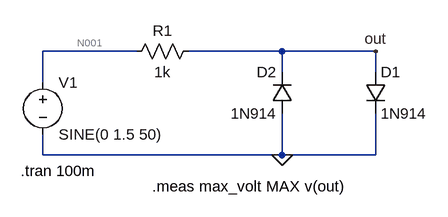
[diagram p0: schematic обмежувач.asc]
обмежувач.asc, the LTspice schematic file:
Version 4
SHEET 1 880 680
WIRE 112 112 -32 112
WIRE 336 112 192 112
WIRE 480 112 336 112
WIRE 336 144 336 112
WIRE 480 144 480 112
WIRE -32 160 -32 112
WIRE -32 272 -32 240
WIRE 336 272 336 208
WIRE 336 272 -32 272
WIRE 480 272 480 208
WIRE 480 272 336 272
FLAG 336 272 0
FLAG 480 112 out
SYMBOL res 208 96 R90
WINDOW 0 0 56 VBottom 2
WINDOW 3 32 56 VTop 2
SYMATTR InstName R1
SYMATTR Value 1k
SYMBOL diode 464 144 R0
SYMATTR InstName D1
SYMATTR Value 1N914
SYMBOL diode 352 208 R180
WINDOW 0 24 64 Left 2
WINDOW 3 24 0 Left 2
SYMATTR InstName D2
SYMATTR Value 1N914
SYMBOL voltage -32 144 R0
WINDOW 123 0 0 Left 2
WINDOW 39 0 0 Left 2
SYMATTR InstName V1
SYMATTR Value SINE(0 1.5 50)
TEXT -66 296 Left 2 !.tran 100m
TEXT 136 320 Left 2 !.meas max_volt MAX v(out)

The netlist it stands for:
* обмежувач.asc
R1 out N001 1k
D1 out 0 1N914
D2 0 out 1N914
V1 N001 0 SINE(0 1.5 50)
.model D D
.lib standard.dio
.tran 100m
.meas max_volt MAX v(out)
.backanno
.end

* Results of the author's LTspice run, read from the files saved beside the schematic
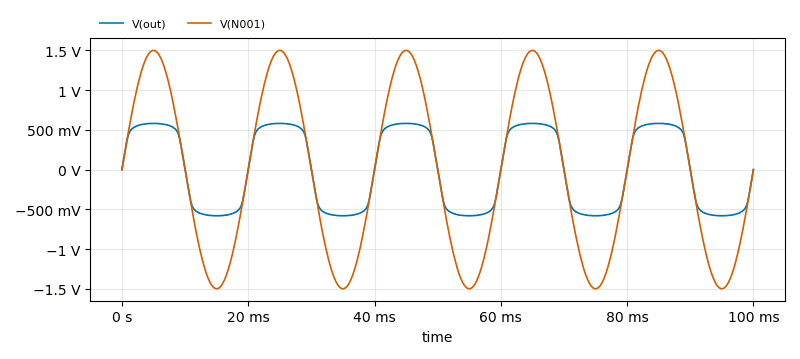
[diagram p1: Transient Analysis of обмежувач.asc, plotted from the saved traces]
* Transient Analysis, 1 run:
*   V(out): min -580.8 mV, max 580.8 mV, average -1.326 µV, rms 507 mV, last -3.778 µV
*   V(N001): min -1.499 V, max 1.499 V, average -595.2 nV, rms 1.06 V, last 0 V
* From the log:
*   max_volt: MAX(v(out))=0.580839 FROM 0 TO 0.1